# EAGLE schematic PCB_Socket (EAGLE 6.5.0)
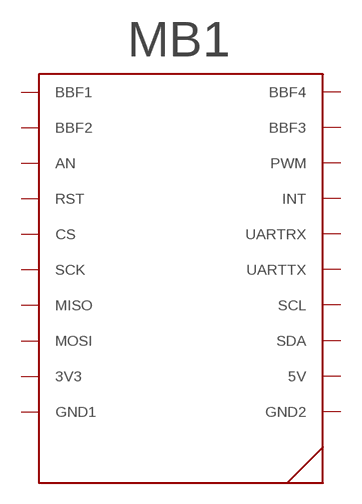
[diagram p0: schematic, sheet 1]

## Parts
MB1  BBF_PCB_SOCKETDEFAULT  [BBF_PCB_SOCKET]
Unconnected: MB1.3V3 MB1.5V MB1.AN MB1.BBF1 MB1.BBF2 MB1.BBF3 MB1.BBF4 MB1.CS MB1.GND1 MB1.GND2 MB1.INT MB1.MISO MB1.MOSI MB1.PWM MB1.RST MB1.SCK MB1.SCL MB1.SDA MB1.UARTRX MB1.UARTTX

## Library data of the parts
MB1 = My_Mikrobus:BBF_PCB_SOCKET

## Net classes
0 default: width 0.203 mm
1 POWER: width 0.762 mm
2 VDD: width 0.762 mm